# Altium schematic sheet Measurement_REO.SchDoc
size 420 x 297 mm; SheetNumber: 4; SheetTotal: 6
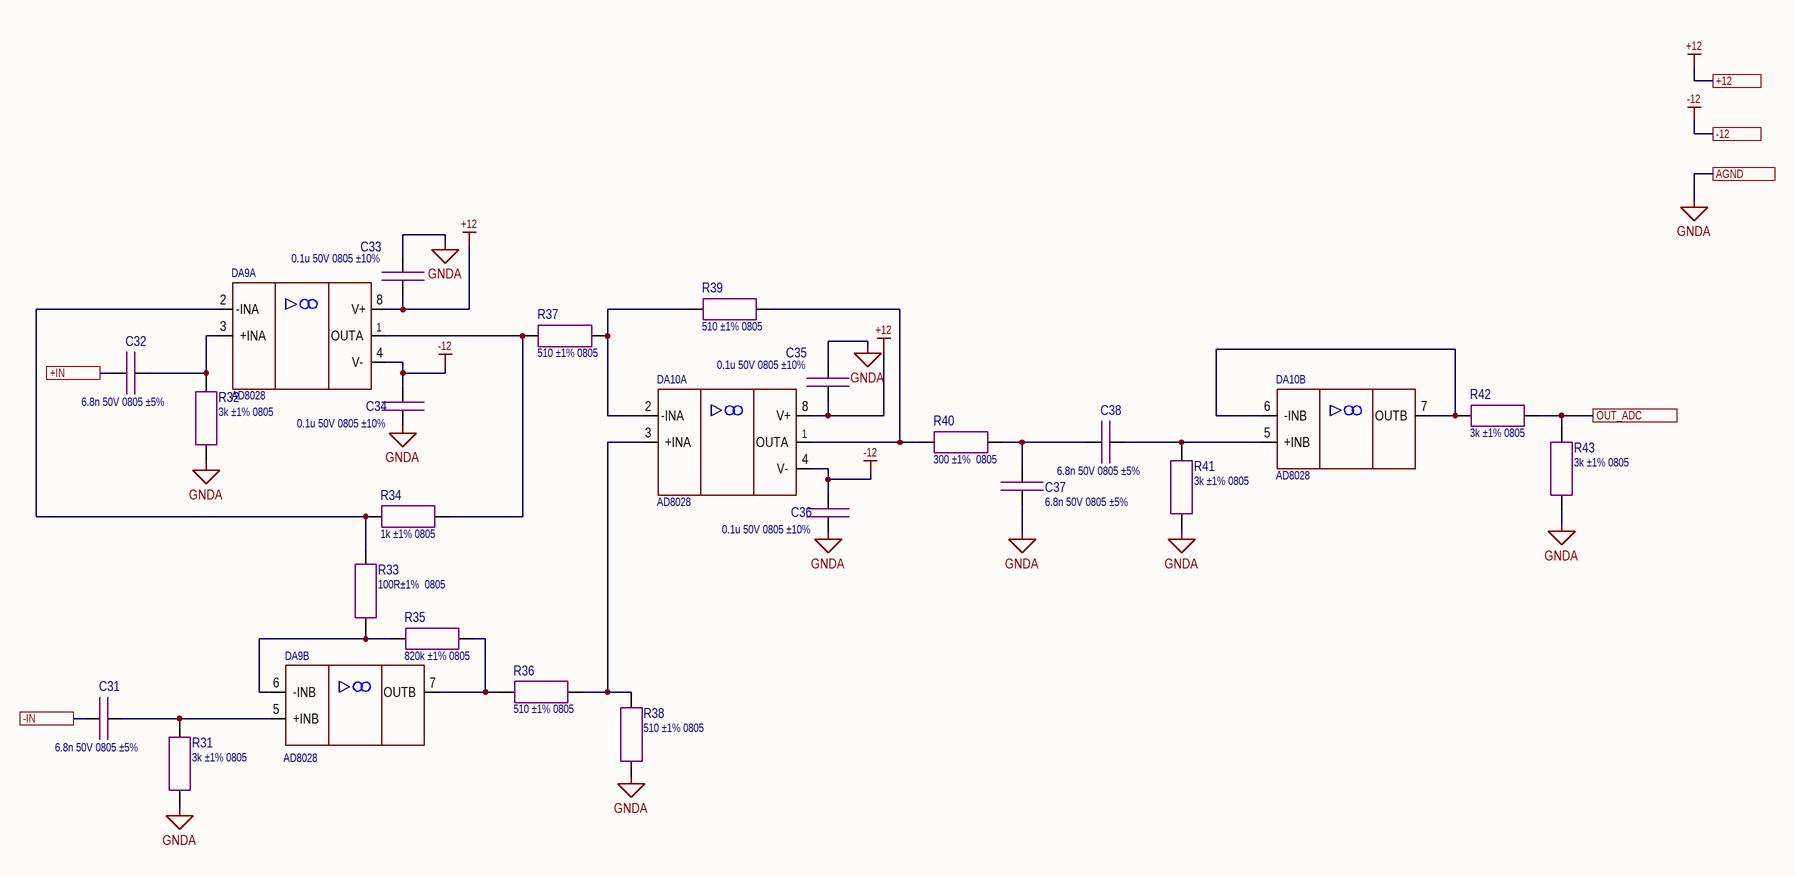
[diagram p0: Measurement_REO.SchDoc]

## Parts
C31  6.8n 50V 0805 ±5%  [CAP: SMD 0805 MD IPC 782]
C32  6.8n 50V 0805 ±5%  [CAP: SMD 0805 MD IPC 782]
C33  0.1u 50V 0805 ±10%  [CAP: SMD 0805 MD IPC 782]
C34  0.1u 50V 0805 ±10%  [CAP: SMD 0805 MD IPC 782]
C35  0.1u 50V 0805 ±10%  [CAP: SMD 0805 MD IPC 782]
C36  0.1u 50V 0805 ±10%  [CAP: SMD 0805 MD IPC 782]
C37  6.8n 50V 0805 ±5%  [CAP: SMD 0805 MD IPC 782]
C38  6.8n 50V 0805 ±5%  [CAP: SMD 0805 MD IPC 782]
DA9  AD8028  [IC: SOIC 8]  (parts A,B of 2)
DA10  AD8028  [IC: SOIC 8]  (parts A,B of 2)
R31  3k ±1% 0805  [RES: SMD 0805 MD IPC 782]
R32  3k ±1% 0805  [RES: SMD 0805 MD IPC 782]
R33  100R±1%  0805  [RES: SMD 0805 MD IPC 782]
R34  1k ±1% 0805  [RES: SMD 0805 MD IPC 782]
R35  820k ±1% 0805  [RES: SMD 0805 MD IPC 782]
R36  510 ±1% 0805  [RES: SMD 0805 MD IPC 782]
R37  510 ±1% 0805  [RES: SMD 0805 MD IPC 782]
R38  510 ±1% 0805  [RES: SMD 0805 MD IPC 782]
R39  510 ±1% 0805  [RES: SMD 0805 MD IPC 782]
R40  300 ±1%  0805  [RES: SMD 0805 MD IPC 782]
R41  3k ±1% 0805  [RES: SMD 0805 MD IPC 782]
R42  3k ±1% 0805  [RES: SMD 0805 MD IPC 782]
R43  3k ±1% 0805  [RES: SMD 0805 MD IPC 782]

## Ports
+12 (see REO_ECG[2B], ECG[4A], Generator_REO[1A], INTERFACES[4A], POWER[1B]), +IN (see REO_ECG[3B]), -12 (see REO_ECG[2B], ECG[4A], Generator_REO[1B], INTERFACES[4A], POWER[1B]), -IN (see REO_ECG[3B]), AGND (see REO_ECG[3B], ECG[4B], Generator_REO[1B], POWER[1B]), OUT_ADC (see REO_ECG[2B])

## Nets
+12: C33.2 C35.2 DA9.8(V+) DA10.8(V+) ; port +12
-12: C34.1 C36.1 DA9.4(V-) DA10.4(V-) ; port -12
GNDA: C33.1 C34.2 C35.1 C36.2 C37.2 R31.2 R32.2 R38.1 R41.2 R43.1 ; port AGND
+IN: C32.2 ; port +IN
-IN: C31.2 ; port -IN
OUT_ADC: R42.2 R43.2 ; port OUT_ADC
NetC31_1: C31.1 DA9.5(+INB) R31.1
NetC32_1: C32.1 DA9.3(+INA) R32.1
NetC37_1: C37.1 C38.2 R40.2
NetC38_1: C38.1 DA10.5(+INB) R41.1
NetDA9_1: DA9.1(OUTA) R34.1 R37.1
NetDA9_2: DA9.2(-INA) R33.2 R34.2
NetDA9_6: DA9.6(-INB) R33.1 R35.2
NetDA9_7: DA9.7(OUTB) R35.1 R36.1
NetDA10_1: DA10.1(OUTA) R39.2 R40.1
NetDA10_2: DA10.2(-INA) R37.2 R39.1
NetDA10_3: DA10.3(+INA) R36.2 R38.2
NetDA10_6: DA10.6(-INB) DA10.7(OUTB) R42.1

## Notes on the sheet
- Подп. и дата
- Инв. № дубл.
- Взам. инв. №
- Инв. № подл.
- Изм.
- Лист
- № докум.
- Подп.
- Дата
- 2.106-A3
- Копировал
- Формат А3

## Library data of the parts
C31 C32 C37 C38 = 6.8n 50V 0805 ±5%: Code: 6279352311; Name: Конденсатор NPO 50V 6800pF ±5% 0805
C33-C36 = 0.1u 50V 0805 ±10%: Code: 6279254871; Name: Конденсатор X7R 50V 0,1uF ±10% 0805
DA9 DA10 = AD8028_part
R31 R32 R41-R43 = 3k ±1% 0805: Code: 6094357331; Name: Резистор 3К ±1% 0805
R33 = 100 ±1%  0805: Code: 6094351171; Name: Резистор 100R±1%  0805
R34 = 1k ±1% 0805: Code: 6027158691; Name: Резистор RC0805FR-071KL, Yageo
R35 = 820k ±1% 0805: Code: 6019041741; Name: Резистор RC0805FR-07820KL, Yageo
R36-R39 = 510 ±1% 0805: Code: 6069137191; Name: Резистор 510R±1%  0805
R40 = 300 ±1%  0805: Code: 6094357025; Name: Резистор 300R±1%  0805